# Altium schematic sheet Audio.SchDoc: Audio
size A4; CompanyName: STMicroelectronics; Organization: Microcontrollers Division; DocumentNumber: 6; SheetNumber: 13; SheetTotal: 19
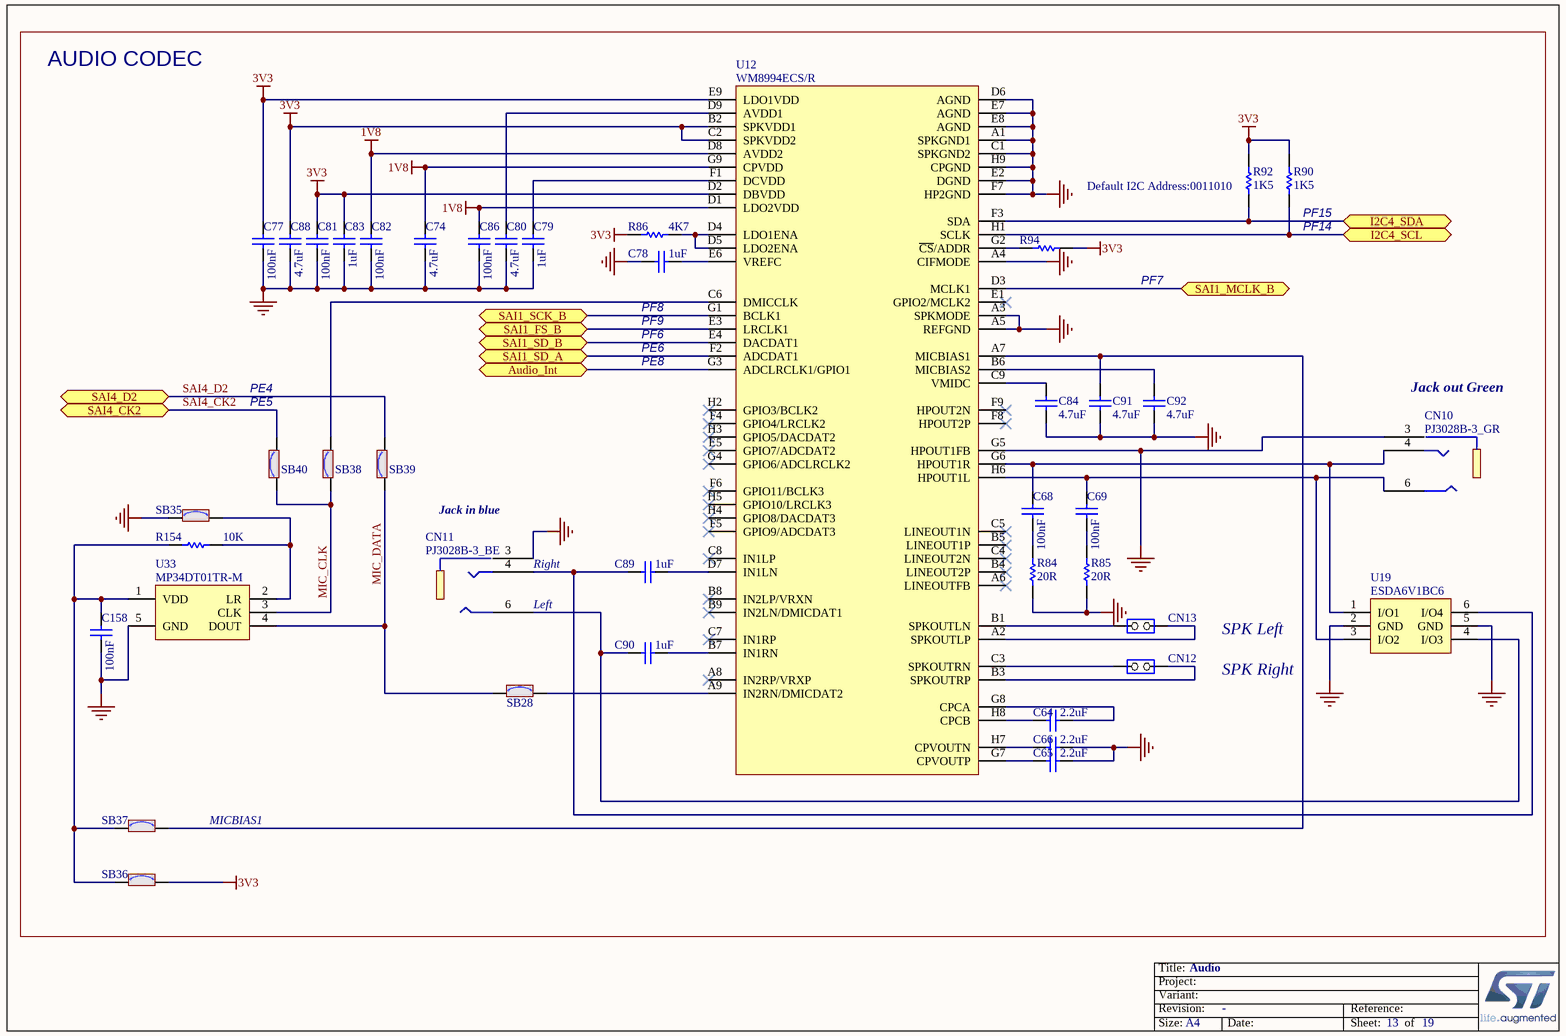
[diagram p0: Audio.SchDoc]

## Parts
C64  value 2.2uF  [C0603]  (hidden comment: Capacitor)
C65  value 2.2uF  [C0603]  (hidden comment: Capacitor)
C66  value 2.2uF  [C0603]  (hidden comment: Capacitor)
C68  value 100nF  [C0402]  (hidden comment: Capacitor)
C69  value 100nF  [C0402]  (hidden comment: Capacitor)
C74  value 4.7uF  [C0603]  (hidden comment: Capacitor)
C77  value 100nF  [C0402]  (hidden comment: Capacitor)
C78  value 1uF  [C0603]  (hidden comment: Capacitor)
C79  value 1uF  [C0603]  (hidden comment: Capacitor)
C80  value 4.7uF  [C0603]  (hidden comment: Capacitor)
C81  value 100nF  [C0402]  (hidden comment: Capacitor)
C82  value 100nF  [C0402]  (hidden comment: Capacitor)
C83  value 1uF  [C0603]  (hidden comment: Capacitor)
C84  value 4.7uF  [C0603]  (hidden comment: Capacitor)
C86  value 100nF  [C0402]  (hidden comment: Capacitor)
C88  value 4.7uF  [C0603]  (hidden comment: Capacitor)
C89  value 1uF  [C0603]  (hidden comment: Capacitor)
C90  value 1uF  [C0603]  (hidden comment: Capacitor)
C91  value 4.7uF  [C0603]  (hidden comment: Capacitor)
C92  value 4.7uF  [C0603]  (hidden comment: Capacitor)
C158  value 100nF  [C0402]  (hidden comment: Capacitor)
CN10  value PJ3028B-3_GR  [CON_PHONE-JACK-3P5_HY_PJ3028B]  (hidden comment: Jack_PJ3028B-3_3P)
CN11  value PJ3028B-3_BE  [CON_PHONE-JACK-3P5_HY_PJ3028B]  (hidden comment: Jack_PJ3028B-3_3P)
CN12  Jumper_Header 2x1  [CON_SAMTEC_TSW-102-07-G-S]  (value not drawn)
CN13  Jumper_Header 2x1  [CON_SAMTEC_TSW-102-07-G-S]  (value not drawn)
R84  value 20R  [R0603]  (hidden comment: Resistor)
R85  value 20R  [R0603]  (hidden comment: Resistor)
R86  value 4K7  [R0603]  (hidden comment: Resistor)
R90  value 1K5  [R0402]  (hidden comment: Resistor)
R92  value 1K5  [R0402]  (hidden comment: Resistor)
R94  Resistor  [R0402]  (value not drawn)
R154  value 10K  [R0402]  (hidden comment: Resistor)
SB28  SB_ON  [SOLDER-BRIDGE_R0603-0R]  (value not drawn)
SB35  SB_ON  [SOLDER-BRIDGE_R0603-0R]  (value not drawn)
SB36  SB_ON  [SOLDER-BRIDGE_R0603-0R]  (value not drawn)
SB37  SB_ON  [SOLDER-BRIDGE_R0603-0R]  (value not drawn)
SB38  SB_ON  [SOLDER-BRIDGE_R0603-0R]  (value not drawn)
SB39  SB_ON  [SOLDER-BRIDGE_R0603-0R]  (value not drawn)
SB40  SB_ON  [SOLDER-BRIDGE_R0603-0R]  (value not drawn)
U12  WM8994ECS/R  [ICC_W-CSP-BGA72_4P511X4P023_P050]
U19  ESDA6V1BC6  [ESD_SOT23-6L]
U33  MP34DT01TR-M  [MIC_HCLGA_3X4X1_4LD]

## Ports
Audio_Int, I2C4_SCL, I2C4_SDA, SAI1_FS_B, SAI1_MCLK_B, SAI1_SCK_B, SAI1_SD_A, SAI1_SD_B, SAI4_CK2, SAI4_D2

## Nets
1V8: C74.2 C82.1 C86.1 U12.D1(LDO2VDD) U12.D8(AVDD2) U12.G9(CPVDD)
3V3: C77.1 C81.1 C83.2 C88.2 R86.1 R90.2 R92.2 R94.1 SB36.2 U12.B2(SPKVDD1) U12.C2(SPKVDD2) U12.D2(DBVDD) U12.E9(LDO1VDD)
GND: C65.1 C66.1 C74.1 C77.2 C78.2 C79.1 C80.1 C81.2 C82.2 C83.1 C84.1 C86.2 C88.1 C91.1 C92.1 C158.2 CN10.3 CN11.3 R84.1 R85.1 SB35.1 U12.A1(SPKGND1) U12.A3(SPKMODE) U12.A4(CIFMODE) U12.A5(REFGND) U12.C1(SPKGND2) U12.D6(AGND) U12.E2(DGND) U12.E7(AGND) U12.E8(AGND) U12.F7(HP2GND) U12.G5(HPOUT1FB) U12.H9(CPGND) U19.2(GND) U19.5(GND) U33.5(GND)
Audio_Int: U12.G3(ADCLRCLK1/GPIO1) ; port Audio_Int
I2C4_SCL: R90.1 U12.H1(SCLK) ; port I2C4_SCL
I2C4_SDA: R92.1 U12.F3(SDA) ; port I2C4_SDA
MIC_CLK: SB38.1 SB40.1 U33.3(CLK)
MIC_DATA: SB28.1 SB39.1 U33.4(DOUT)
SAI1_FS_B: U12.E3(LRCLK1) ; port SAI1_FS_B
SAI1_MCLK_B: U12.D3(MCLK1) ; port SAI1_MCLK_B
SAI1_SCK_B: U12.G1(BCLK1) ; port SAI1_SCK_B
SAI1_SD_A: U12.F2(ADCDAT1) ; port SAI1_SD_A
SAI1_SD_B: U12.E4(DACDAT1) ; port SAI1_SD_B
SAI4_CK2: SB40.2 ; port SAI4_CK2
SAI4_D2: SB39.2 ; port SAI4_D2
NetC64_1: C64.1 U12.G8(CPCA)
NetC64_2: C64.2 U12.H8(CPCB)
NetC65_2: C65.2 U12.G7(CPVOUTP)
NetC66_2: C66.2 U12.H7(CPVOUTN)
NetC68_1: C68.1 CN10.4 U12.G6(HPOUT1R) U19.1(I/O1)
NetC68_2: C68.2 R84.2
NetC69_1: C69.1 CN10.6 U12.H6(HPOUT1L) U19.3(I/O2)
NetC69_2: C69.2 R85.2
NetC78_1: C78.1 U12.E6(VREFC)
NetC79_2: C79.2 U12.F1(DCVDD)
NetC80_2: C80.2 U12.D9(AVDD1)
NetC84_2: C84.2 U12.C9(VMIDC)
NetC89_1: C89.1 U12.D7(IN1LN)
NetC89_2: C89.2 CN11.4 U19.6(I/O4)
NetC90_1: C90.1 U12.B7(IN1RN)
NetC90_2: C90.2 CN11.6 U19.4(I/O3)
NetC91_2: C91.2 SB37.2 U12.A7(MICBIAS1)
NetC92_2: C92.2 U12.B6(MICBIAS2)
NetC158_1: C158.1 R154.2 SB36.1 SB37.1 U33.1(VDD)
NetCN12_1: CN12.1(COMMON) U12.B3(SPKOUTRP)
NetCN12_2: CN12.2(NO) U12.C3(SPKOUTRN)
NetCN13_1: CN13.1(COMMON) U12.A2(SPKOUTLP)
NetCN13_2: CN13.2(NO) U12.B1(SPKOUTLN)
NetR86_2: R86.2 U12.D4(LDO1ENA) U12.D5(LDO2ENA)
NetR94_2: R94.2 U12.G2(~{CS}/ADDR)
NetR154_1: R154.1 SB35.2 U33.2(LR)
NetSB28_2: SB28.2 U12.A9(IN2RN/DMICDAT2)
NetSB38_2: SB38.2 U12.C6(DMICCLK)

Not connected (* = marked no-connect by the designer): U12 A6(LINEOUTFB)* A8(IN2RP/VRXP)* B4(LINEOUT2P)* B5(LINEOUT1P)* B8(IN2LP/VRXN)* B9(IN2LN/DMICDAT1)* C4(LINEOUT2N)* C5(LINEOUT1N)* C7(IN1RP)* C8(IN1LP)* E1(GPIO2/MCLK2)* E5(GPIO7/ADCDAT2)* F4(GPIO4/LRCLK2)* F5(GPIO9/ADCDAT3)* F6(GPIO11/BCLK3)* F8(HPOUT2P)* F9(HPOUT2N)* G4(GPIO6/ADCLRCLK2)* H2(GPIO3/BCLK2)* H3(GPIO5/DACDAT2)* H4(GPIO8/DACDAT3)* H5(GPIO10/LRCLK3)*

## Notes on the sheet
- AUDIO CODEC
- (near R92) Default I2C Address:0011010
- (near R90) PF15
- (near R90) PF14
- (near C78) PF8
- PF7
- PF6
- PF9
- PE8
- PE6
- PE4
- (near SB40) PE5
- (near CN10) Jack out Green
- Jack in blue
- (near CN11) Right
- (near CN11) Left
- SPK Left
- SPK Right
- MICBIAS1
- Title:
- Project:
- Size:
- Revision:
- Variant:
- A4
- -
- Date:
- Reference:
- Sheet:
- of

## Library data of the parts
C64-C66 = MCD-00012: Capacitor, MLCC, 2.2uF, 10V, X5R, 10%, 0603, T=0,8mm; Manufacturer_Part_Number: CC0603KRX5R6BB225; Manufacturer: YAGEO; Alternate_Manufacturer_Part_Number: C0603C225K8PACTU; Alternate_Manufacturer: KEMET; Provided_By: SUBCO; Internal_Part_Number: MCD-00012; Status: Released; Part_Type: Capacitor; Package: C0603; ComponentLink1Description: Datasheet; ComponentLink1URL: http://tunmcdsvn.tun.st.com/Component_Datasheet_Library/Trunk/Capacitors/Yageo_Multilayer_capacitor_X5R_series_100pF_to_100uF
C68 C69 C77 C81 C82 C86 C158 = MCD-00102: Capacitor, MLCC, 100nF, 16V, X7R, 10%, 0402, T=0,5mm; Manufacturer_Part_Number: CC0402KRX7R7BB104; Manufacturer: YAGEO; Alternate_Manufacturer_Part_Number: GCM155R71C104KA55D; Alternate_Manufacturer: MURATA; Provided_By: SUBCO; Internal_Part_Number: MCD-00102; Status: Released; Part_Type: Capacitor; Package: C0402; ComponentLink1Description: Datasheet; ComponentLink1URL: http://tunmcdsvn.tun.st.com/Component_Datasheet_Library/Trunk/Capacitors/Yageo_Multilayer_Capacitor_X7R_series_100pF_to_22uF
C74 C80 C84 C88 C91 C92 = MCD-00009: Capacitor, MLCC, 4.7uF, 16V, X5R, 10%, 0603, T=0.8mm; Manufacturer_Part_Number: CC0603KRX5R7BB475; Manufacturer: YAGEO; Provided_By: SUBCO; Internal_Part_Number: MCD-00009; Status: Released; Part_Type: Capacitor; Package: C0603; ComponentLink1Description: Datasheet; ComponentLink1URL: http://tunmcdsvn.tun.st.com/Component_Datasheet_Library/Trunk/Capacitors/Yageo_Multilayer_capacitor_X5R_series_100pF_to_100uF
C78 C79 C83 C89 C90 = MCD-00010: Capacitor, MLCC, 1uF, 16V, X5R, 10%, 0603, T=0,8mm; Manufacturer_Part_Number: CC0603KRX5R7BB105; Manufacturer: YAGEO; Provided_By: SUBCO; Internal_Part_Number: MCD-00010; Status: Released; Part_Type: Capacitor; Package: C0603; ComponentLink1Description: Datasheet; ComponentLink1URL: http://tunmcdsvn.tun.st.com/Component_Datasheet_Library/Trunk/Capacitors/Yageo_Multilayer_capacitor_X5R_series_100pF_to_100uF
CN10 = MCD-00018: Connector Jack socket Stereo 3.5mm, 3 pins, RA, SMT, Green (Line output); Manufacturer: QIAOD; Alternate_Manufacturer_Part_Number: PJ30280-3_GR; Provided_By: SUBCO; Internal_Part_Number: MCD-00018; Status: Released; Part_Type: Connector; Manufacturer_Part_Number: PJ3028B-3_GR; Alternate_Manufacturer: QIAOD; ComponentLink1Description: Datasheet; ComponentLink1URL: http://tunmcdsvn.tun.st.com/Component_Datasheet_Library/Trunk/Connectors/QIAOD_PJ-3028B-3-XX
CN11 = MCD-00682: Connector Jack socket Stereo 3.5mm, 3 pins, RA, SMT, Blue (Line input); Manufacturer: QIAOD; Alternate_Manufacturer_Part_Number: PJ30280-3_BE; Provided_By: SUBCO; Internal_Part_Number: MCD-00682; Status: Footprint available; Part_Type: Connector; Manufacturer_Part_Number: PJ3028B-3_BE; Alternate_Manufacturer: QIAOD; ComponentLink1Description: Datasheet; ComponentLink1URL: http://tunmcdsvn.tun.st.com/Component_Datasheet_Library/Trunk/Connectors/QIAOD_PJ-3028B-3-XX
CN12 CN13 = MCD-00045: Header, 2x1, 2,54mm, VR, TH, Height 5.84mm/2.54mm; Part_Type: Connector; Manufacturer_Part_Number: TSW-102-07-x-S; Manufacturer: SAMTEC; Alternate_Manufacturer_Part_Number: 313102S111116; Alternate_Manufacturer: JIUBABA; Value: Shunt not fitted; Provided_By: SUBCO; Internal_Part_Number: MCD-00045; Status: Released; ComponentLink1Description: Datasheet; ComponentLink1URL: http://tunmcdsvn.tun.st.com/Component_Datasheet_Library/Trunk/Connectors/Samtec_TSW-HTSW-series
R84 R85 = MCD-00345: Resistor,20R,0603,1%,1/10W; Manufacturer_Part_Number: RC0603FR-0720RL; Manufacturer: YAGEO; Provided_By: SUBCO; Internal_Part_Number: MCD-00345; Status: Released; Part_Type: Resistor; Package: R0603; ComponentLink1Description: Datasheet; ComponentLink1URL: http://tunmcdsvn.tun.st.com/Component_Datasheet_Library/Trunk/Resistors/Yageo_Resistor_RC0603-series
R86 = MCD-00219: Resistor,4K7,0603,1%,1/10W; Manufacturer_Part_Number: RC0603FR-074K7L; Manufacturer: YAGEO; Provided_By: SUBCO; Internal_Part_Number: MCD-00219; Status: Released; Part_Type: Resistor; Package: R0603; ComponentLink1Description: Datasheet; ComponentLink1URL: http://tunmcdsvn.tun.st.com/Component_Datasheet_Library/Trunk/Resistors/Yageo_Resistor_RC0603-series
R90 R92 = MCD-00068: Resistor,1K5,0402,1%,1/16W; Manufacturer_Part_Number: RC0402FR-071K5L; Manufacturer: YAGEO; Provided_By: SUBCO; Internal_Part_Number: MCD-00068; Status: Released; Part_Type: Resistor; Package: R0402; ComponentLink1Description: Datasheet; ComponentLink1URL: http://tunmcdsvn.tun.st.com/Component_Datasheet_Library/Trunk/Resistors/Yageo_Resistor_RC0402-series
R94 R154 = MCD-00053: Resistor,10K,0402,1%,1/16W; Manufacturer_Part_Number: RC0402FR-0710KL; Manufacturer: YAGEO; Provided_By: SUBCO; Internal_Part_Number: MCD-00053; Status: Released; Part_Type: Resistor; Package: R0402; ComponentLink1Description: Datasheet; ComponentLink1URL: http://tunmcdsvn.tun.st.com/Component_Datasheet_Library/Trunk/Resistors/Yageo_Resistor_RC0402-series
  R94: Value: 10K
SB28 SB35-SB40 = MCD-00071: Solder Bridge ON; Part_Type: Mechanical; Manufacturer_Part_Number: RC0603JR-070RL; Manufacturer: YAGEO; Provided_By: SUBCO; Internal_Part_Number: MCD-00071; Status: Released; Package: SB0603; ComponentLink1Description: Datasheet; ComponentLink1URL: http://tunmcdsvn.tun.st.com/Component_Datasheet_Library/Trunk/Resistors/Yageo_Resistor_RC0603-series
U12 = MCD-00079: Multi-Channel Audio Hub CODEC for Smartphones; Part_Type: IC; Manufacturer: CIRRUS LOGIC; Provided_By: SUBCO; Internal_Part_Number: MCD-00079; Value: WM8994ECS/R; Status: Released; Manufacturer_Part_Number: WM8994ECS/R; ComponentLink1Description: Datasheet; ComponentLink1URL: http://tunmcdsvn.tun.st.com/Component_Datasheet_Library/Trunk/IC/Wolfson_AudioCodec_WM8994
U19 = MCD-00247: Quad Bidir ESD protection; Part_Type: Diode; Manufacturer: STMICROELECTRONICS; BMS_Part_Number: 9179038; Provided_By: SUBCO with ST control; Internal_Part_Number: MCD-00247; Value: ESDA6V1BC6; Status: Released; Manufacturer_Part_Number: ESDA6V1BC6; ComponentLink1Description: Datasheet; ComponentLink1URL: http://tunmcdsvn.tun.st.com/Component_Datasheet_Library/Trunk/Diodes/STM_ESD_ESDA6V1BC6
U33 = MCD-00081: MEMS audio sensor, omnidirectional digital microphone; Part_Type: IC; Manufacturer: STMICROELECTRONICS; BMS_Part_Number: 9188008; Provided_By: SUBCO with ST control; Internal_Part_Number: MCD-00081; Value: MP34DT01TR-M; Status: NRND (Not Recommended for New Design); Manufacturer_Part_Number: MP34DT01TR-M; ComponentLink1Description: Datasheet; ComponentLink1URL: http://tunmcdsvn.tun.st.com/Component_Datasheet_Library/Trunk/IC/STM_Digital-Microphone_MP34DT01TR_M